# Altium project PCB_Project.PrjPcb
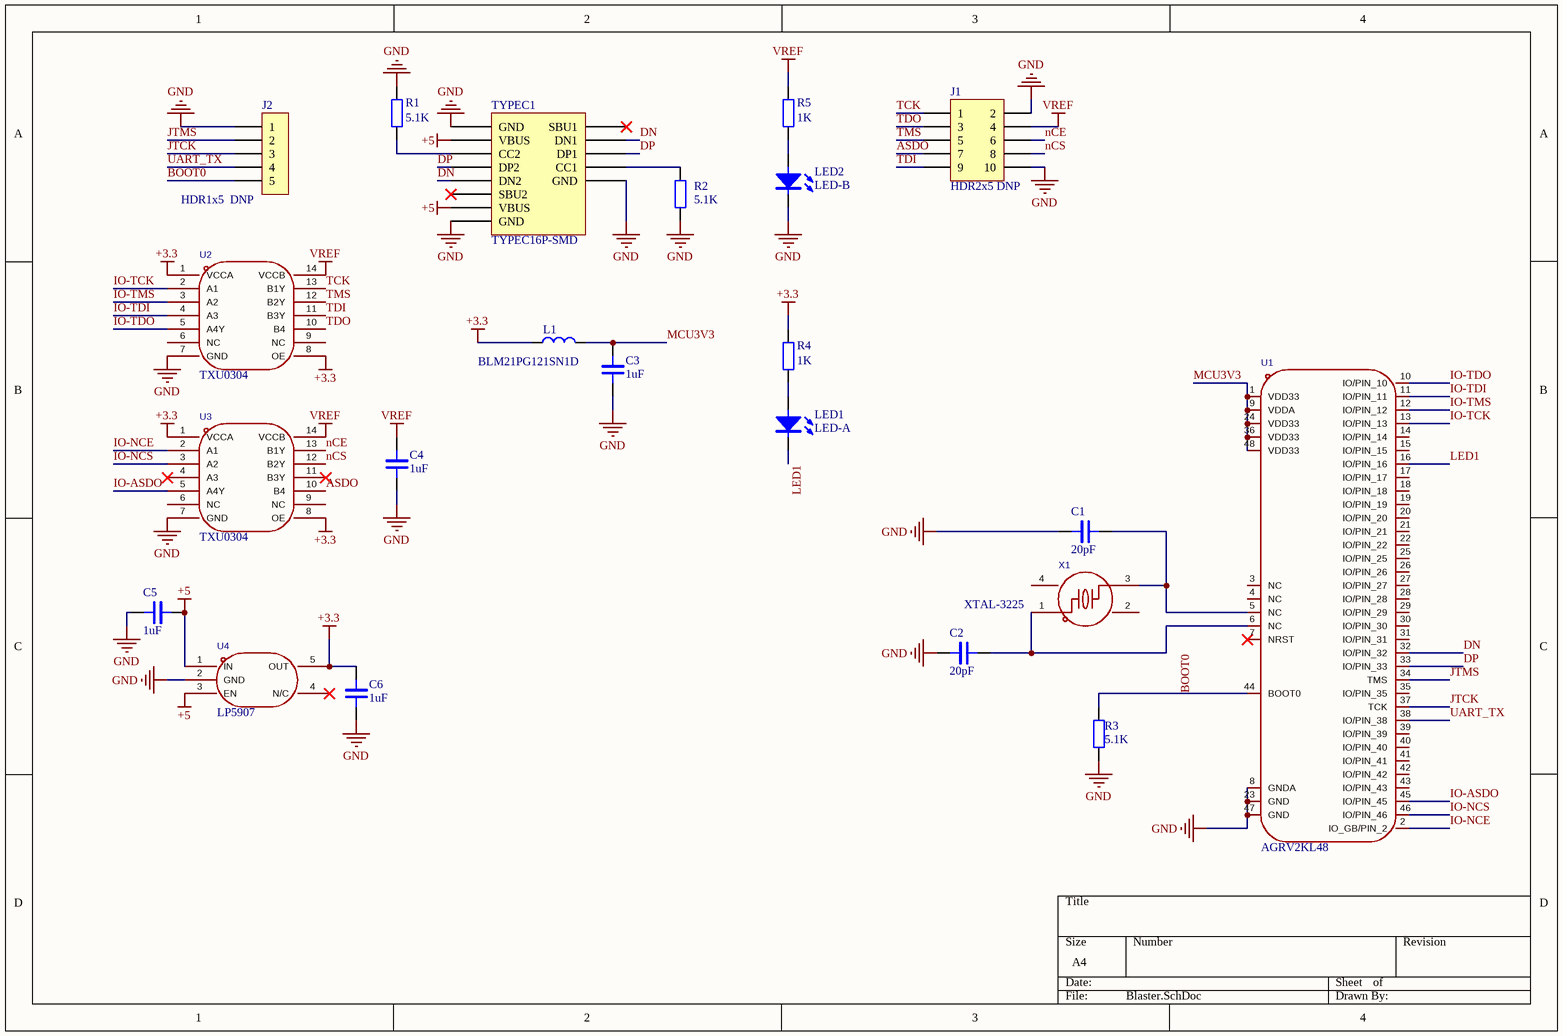
[diagram p0: Blaster.SchDoc]
1 sheet, 22 parts. Net scope: global (net labels, ports and power ports of the same name join across sheets).
Board files: BlasterV1.2.PcbDoc, BlasterV1.3.PcbDoc, BlasterV1.3L64.PcbDoc

## Sheet Blaster.SchDoc
size A4; SheetNumber: 1; SheetTotal: 1

### Parts
C1  20pF  [LC-0603_C]
C2  20pF  [LC-0603_C]
C3  1uF  [LC-0603_C]
C4  1uF  [LC-0603_C]
C5  1uF  [LC-0603_C]
C6  1uF  [LC-0603_C]
J1  HDR2x5 DNP  [HDR-M-2.54_2X5_SMT]  (no BOM)
J2  HDR1x5  DNP  [PIN-5-2.54-1.0]  (no BOM)
L1  BLM21PG121SN1D  [LC-0603_L]
LED1  LED-A  [LED-0603]
LED2  LED-B  [LED-0603]
R1  5.1K  [LC-0603_R]
R2  5.1K  [LC-0603_R]
R3  5.1K  [LC-0603_R]
R4  1K  [LC-0603_R]
R5  1K  [LC-0603_R]
TYPEC1  TYPEC16P-SMD  [TYPE-C-Receptacle-2.0]
U1  AGRV2KL48  [LQFP48 7X7_N]
U2  TXU0304  [TSSOP14_N]
U3  TXU0304  [TSSOP14_N]
U4  LP5907  [SOT23-5N]
X1  XTAL-3225  [XTAL-3225]

### Nets
+3.3: C6.2 L1.1 R4.1 U2.1(VCCA) U2.8(OE) U3.1(VCCA) U3.8(OE) U4.5(OUT)
+5: C5.1 TYPEC1.A4(VBUS) TYPEC1.B4(VBUS) U4.1(IN) U4.3(EN)
GND: C1.2 C2.2 C3.2 C4.2 C5.2 C6.1 J1.2 J1.10 J2.1 LED2.2(C) R1.1 R2.1 R3.1 TYPEC1.0(GND) TYPEC1.A1(GND) TYPEC1.B1(GND) U1.8(GNDA) U1.23(GND) U1.47(GND) U2.7(GND) U3.7(GND) U4.2(GND)
VREF: C4.1 J1.4 R5.1 U2.14(VCCB) U3.14(VCCB)
ASDO: J1.7 U3.10(B4)
BOOT0: J2.5 R3.2 U1.44(BOOT0)
DN: TYPEC1.A7(DN1) TYPEC1.B7(DN2) U1.32(IO/PIN_32)
DP: TYPEC1.A6(DP1) TYPEC1.B6(DP2) U1.33(IO/PIN_33)
IO-ASDO: U1.45(IO/PIN_45) U3.5(A4Y)
IO-NCE: U1.2(IO_GB/PIN_2) U3.2(A1)
IO-NCS: U1.46(IO/PIN_46) U3.3(A2)
IO-TCK: U1.13(IO/PIN_13) U2.2(A1)
IO-TDI: U1.11(IO/PIN_11) U2.4(A3)
IO-TDO: U1.10(IO/PIN_10) U2.5(A4Y)
IO-TMS: U1.12(IO/PIN_12) U2.3(A2)
JTCK: J2.3 U1.37(TCK)
JTMS: J2.2 U1.34(TMS)
LED1: LED1.2(C) U1.16(IO/PIN_16)
MCU3V3: C3.1 L1.2 U1.1(VDD33) U1.9(VDDA) U1.24(VDD33) U1.36(VDD33) U1.48(VDD33)
nCE: J1.6 U3.13(B1Y)
nCS: J1.8 U3.12(B2Y)
TCK: J1.1 U2.13(B1Y)
TDI: J1.9 U2.11(B3Y)
TDO: J1.3 U2.10(B4)
TMS: J1.5 U2.12(B2Y)
UART_TX: J2.4 U1.38(IO/PIN_38)
NetC1_1: C1.1 U1.5(NC) X1.3
NetC2_1: C2.1 U1.6(NC) X1.1
NetLED1_1: LED1.1(A) R4.2
NetLED2_1: LED2.1(A) R5.2
NetR1_2: R1.2 TYPEC1.B5(CC2)
NetR2_2: R2.2 TYPEC1.A5(CC1)

Not connected (* = marked no-connect by the designer): TYPEC1 A8(SBU1)* B8(SBU2)*; U1 3(NC) 4(NC) 7(NRST)* 14(IO/PIN_14) 15(IO/PIN_15) 17(IO/PIN_17) 18(IO/PIN_18) 19(IO/PIN_19) 20(IO/PIN_20) 21(IO/PIN_21) 22(IO/PIN_22) 25(IO/PIN_25) 26(IO/PIN_26) 27(IO/PIN_27) 28(IO/PIN_28) 29(IO/PIN_29) 30(IO/PIN_30) 31(IO/PIN_31) 35(IO/PIN_35) 39(IO/PIN_39) 40(IO/PIN_40) 41(IO/PIN_41) 42(IO/PIN_42) 43(IO/PIN_43); U2 6(NC) 9(NC); U3 4(A3)* 6(NC) 9(NC) 11(B3Y)*; U4 4(N/C)*; X1 2(GND) 4(GND)

### Library data of the parts
C1-C6 = CAP: Capacitor
J1 = HDR2x5: Connector
J2 = HDR1x5
L1 = INDUCTANCE
LED1 LED2 = LED
R1 R4 R5 = RES: Resistor
R2 R3 = RES
U1 = AGRV2KL48: Symbol: AGRV2KL48_C41397168
U2 U3 = TXU0304: Symbol: GTXU0304TD
U4 = LP5907MFX-3.3/NOPB: Symbol: LP5907MFX-3.3/NOPB
X1 = XTAL-4P: Symbol: XL2EL89CSI-KPIYLC-8M